# Altium project DigiTune.PrjPcb
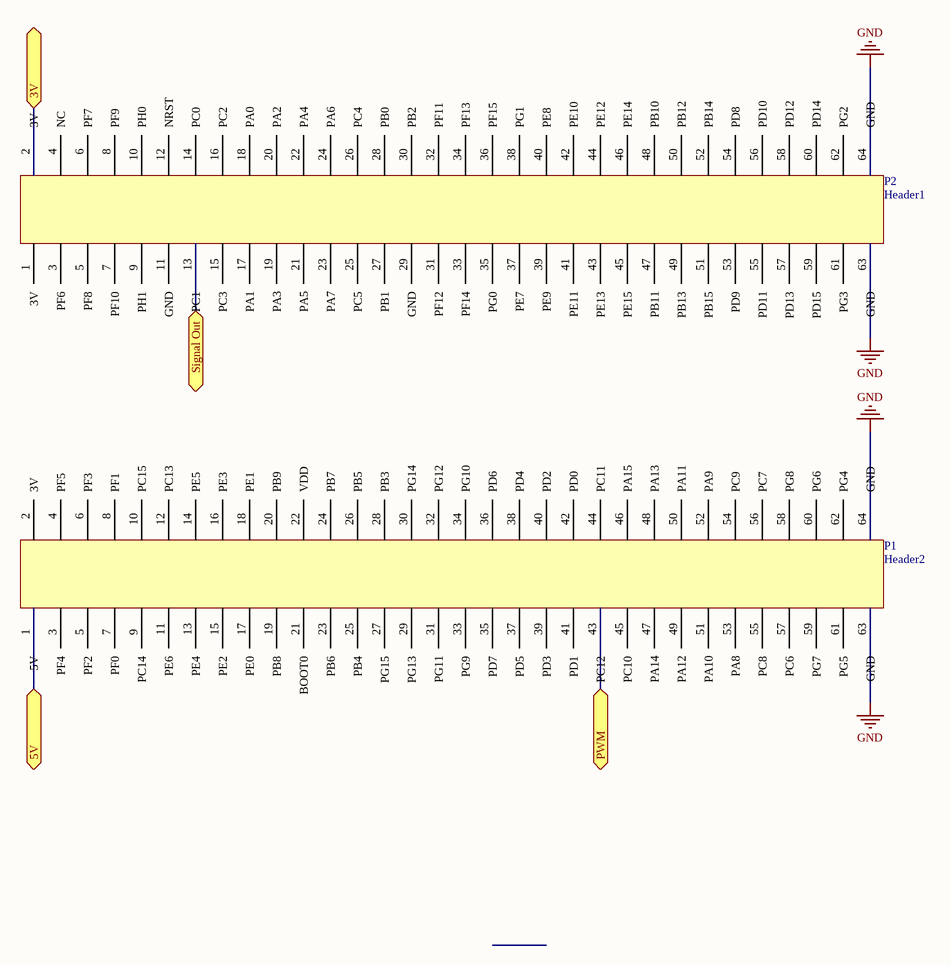
[diagram p0: STM32Headers.SchDoc]
1 sheet, 2 parts. Net scope: flat (ports and power ports of the same name join across sheets).
Board file: DigiTune.PcbDoc

## Sheet STM32Headers.SchDoc
size A4

### Parts
P1  Header2  [STM32F4DiscoHeader]
P2  Header1  [STM32F4DiscoHeader]

### Ports
3V, 5V, PWM, Signal Out

### Nets
GND: P1.63(GND) P1.64(GND) P2.63(GND) P2.64(GND)
NetP1_1: P1.1(5V) ; port 5V
NetP1_43: P1.43(PC12) ; port PWM
NetP2_2: P2.2(3V) ; port 3V
NetP2_13: P2.13(PC1) ; port Signal Out

Not connected (* = marked no-connect by the designer): P1 2(3V) 3(PF4) 4(PF5) 5(PF2) 6(PF3) 7(PF0) 8(PF1) 9(PC14) 10(PC15) 11(PE6) 12(PC13) 13(PE4) 14(PE5) 15(PE2) 16(PE3) 17(PE0) 18(PE1) 19(PB8) 20(PB9) 21(BOOT0) 22(VDD) 23(PB6) 24(PB7) 25(PB4) 26(PB5) 27(PG15) 28(PB3) 29(PG13) 30(PG14) 31(PG11) 32(PG12) 33(PG9) 34(PG10) 35(PD7) 36(PD6) 37(PD5) 38(PD4) 39(PD3) 40(PD2) 41(PD1) 42(PD0) 44(PC11) 45(PC10) 46(PA15) 47(PA14) 48(PA13) 49(PA12) 50(PA11) 51(PA10) 52(PA9) 53(PA8) 54(PC9) 55(PC8) 56(PC7) 57(PC6) 58(PG8) 59(PG7) 60(PG6) 61(PG5) 62(PG4); P2 1(3V) 3(PF6) 4(NC) 5(PF8) 6(PF7) 7(PF10) 8(PF9) 9(PH1) 10(PH0) 11(GND) 12(NRST) 14(PC0) 15(PC3) 16(PC2) 17(PA1) 18(PA0) 19(PA3) 20(PA2) 21(PA5) 22(PA4) 23(PA7) 24(PA6) 25(PC5) 26(PC4) 27(PB1) 28(PB0) 29(GND) 30(PB2) 31(PF12) 32(PF11) 33(PF14) 34(PF13) 35(PG0) 36(PF15) 37(PE7) 38(PG1) 39(PE9) 40(PE8) 41(PE11) 42(PE10) 43(PE13) 44(PE12) 45(PE15) 46(PE14) 47(PB11) 48(PB10) 49(PB13) 50(PB12) 51(PB15) 52(PB14) 53(PD9) 54(PD8) 55(PD11) 56(PD10) 57(PD13) 58(PD12) 59(PD15) 60(PD14) 61(PG3) 62(PG2)

### Library data of the parts
P1 = Component_1
P2 = Component_1: Header for STM32F429 pinout